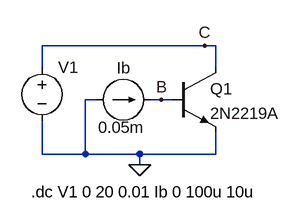
[diagram p0: schematic Fig_6-18_2N2219_V-I.asc]
Fig_6-18_2N2219_V-I.asc, the LTspice schematic file:
Version 4
SHEET 1 880 680
WIRE 224 96 -16 96
WIRE 240 96 224 96
WIRE -16 128 -16 96
WIRE 240 128 240 96
WIRE 64 176 48 176
WIRE 160 176 144 176
WIRE 176 176 160 176
WIRE -16 256 -16 208
WIRE 48 256 48 176
WIRE 48 256 -16 256
WIRE 128 256 48 256
WIRE 240 256 240 224
WIRE 240 256 128 256
WIRE 128 272 128 256
FLAG 128 272 0
FLAG 224 96 C
FLAG 160 176 B
SYMBOL npn 176 128 R0
SYMATTR InstName Q1
SYMATTR Value 2N2219A
SYMBOL current 64 176 R270
WINDOW 0 32 40 VTop 2
WINDOW 3 -56 37 VTop 2
WINDOW 123 0 0 Left 2
WINDOW 39 0 0 Left 2
SYMATTR InstName Ib
SYMATTR Value 0.05m
SYMBOL voltage -16 112 R0
WINDOW 123 0 0 Left 2
WINDOW 39 0 0 Left 2
SYMATTR InstName V1
SYMATTR Value ""
TEXT -32 312 Left 2 !.dc V1 0 20 0.01 Ib 0 100u 10u

The netlist it stands for:
* Fig_6-18_2N2219_V-I.asc
Q1 C B 0 0 2N2219A
Ib 0 B 0.05m
V1 C 0
.model NPN NPN
.model PNP PNP
.lib standard.bjt
.dc V1 0 20 0.01 Ib 0 100u 10u
.backanno
.end